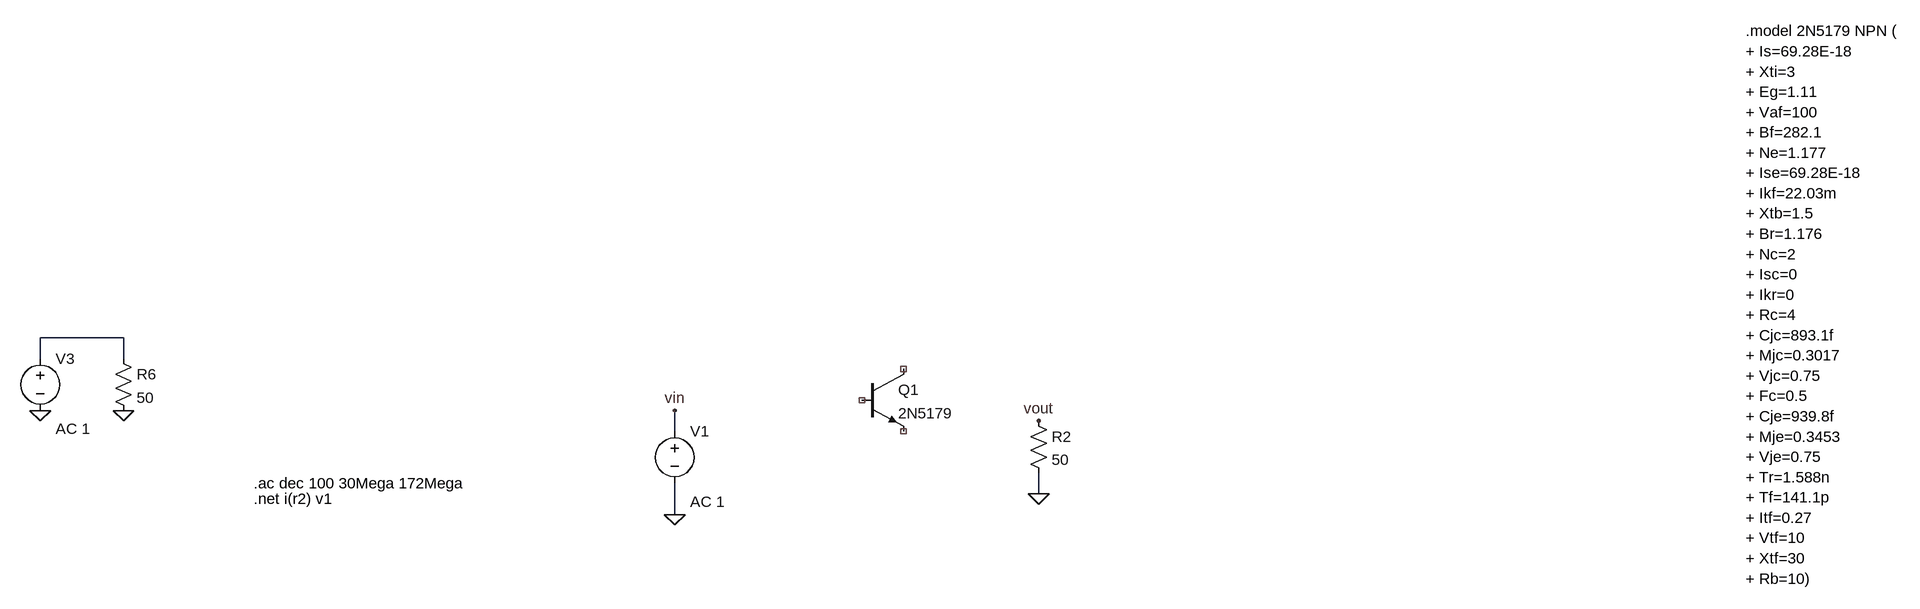
[diagram p0: schematic VHFLNASimulation.asc]
VHFLNASimulation.asc, the LTspice schematic file:
Version 4.1
SHEET 1 1768 936
WIRE -1664 224 -1792 224
WIRE -1792 256 -1792 224
WIRE -1664 256 -1664 224
WIRE -816 368 -816 336
WIRE -256 464 -256 432
WIRE -816 496 -816 448
FLAG -1664 336 0
FLAG -1792 336 0
FLAG -256 464 0
FLAG -816 496 0
FLAG -816 336 vin
FLAG -256 352 vout
SYMBOL npn -528 272 R0
SYMATTR InstName Q1
SYMATTR Value 2N5179
SYMBOL voltage -1792 240 R0
WINDOW 123 24 124 Left 2
WINDOW 39 0 0 Left 0
SYMATTR Value2 AC 1
SYMATTR InstName V3
SYMATTR Value ""
SYMBOL res -1680 240 R0
SYMATTR InstName R6
SYMATTR Value 50
SYMBOL res -272 336 R0
SYMATTR InstName R2
SYMATTR Value 50
SYMBOL voltage -816 352 R0
WINDOW 123 24 124 Left 2
WINDOW 39 0 0 Left 0
SYMATTR Value2 AC 1
SYMATTR InstName V1
SYMATTR Value ""
TEXT 832 -248 Left 2 !.model 2N5179 NPN (\n+ Is=69.28E-18\n+ Xti=3\n+ Eg=1.11\n+ Vaf=100\n+ Bf=282.1\n+ Ne=1.177\n+ Ise=69.28E-18\n+ Ikf=22.03m\n+ Xtb=1.5\n+ Br=1.176\n+ Nc=2\n+ Isc=0\n+ Ikr=0\n+ Rc=4\n+ Cjc=893.1f\n+ Mjc=0.3017\n+ Vjc=0.75\n+ Fc=0.5\n+ Cje=939.8f\n+ Mje=0.3453\n+ Vje=0.75\n+ Tr=1.588n\n+ Tf=141.1p\n+ Itf=0.27\n+ Vtf=10\n+ Xtf=30\n+ Rb=10)
TEXT -1464 448 Left 2 !.ac dec 100 30Mega 172Mega
TEXT -1464 472 Left 2 !.net i(r2) v1

The netlist it stands for:
* VHFLNASimulation.asc
Q1 NC_01 NC_02 NC_03 0 2N5179
V3 N001 0 AC 1
R6 N001 0 50
R2 vout 0 50
V1 vin 0 AC 1
.model NPN NPN
.model PNP PNP
.lib standard.bjt
.model 2N5179 NPN (
+ Is=69.28E-18
+ Xti=3
+ Eg=1.11
+ Vaf=100
+ Bf=282.1
+ Ne=1.177
+ Ise=69.28E-18
+ Ikf=22.03m
+ Xtb=1.5
+ Br=1.176
+ Nc=2
+ Isc=0
+ Ikr=0
+ Rc=4
+ Cjc=893.1f
+ Mjc=0.3017
+ Vjc=0.75
+ Fc=0.5
+ Cje=939.8f
+ Mje=0.3453
+ Vje=0.75
+ Tr=1.588n
+ Tf=141.1p
+ Itf=0.27
+ Vtf=10
+ Xtf=30
+ Rb=10)
.ac dec 100 30Mega 172Mega
.net i(r2) v1
.backanno
.end